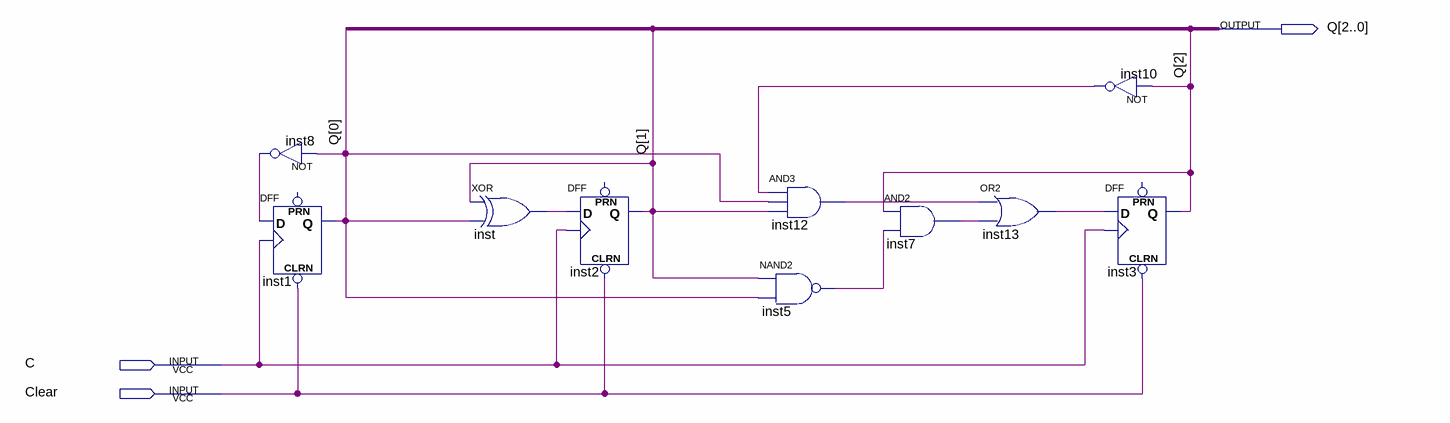
[diagram p0: schematic sheet]
// Quartus schematic SyncCNT.bdf as structural Verilog: 10 symbols, 3 pins
module SyncCNT (
  input  C,
  input  Clear,
  output [2:0] Q
);

  wire inst5_out, inst7_out, inst8_out, inst10_out, inst12_out, inst13_out, inst_out;

  not inst8 (inst8_out, Q[0]);
  DFF inst1 (.CLRN(Clear), .CLK(C), .D(inst8_out), .Q(Q[0]));  // open: PRN
  xor inst (inst_out, Q[1], Q[0]);
  DFF inst2 (.CLRN(Clear), .CLK(C), .D(inst_out), .Q(Q[1]));  // open: PRN
  and inst12 (inst12_out, inst10_out, Q[0], Q[1]);
  nand inst5 (inst5_out, Q[1], Q[0]);
  and inst7 (inst7_out, Q[2], inst5_out);
  or inst13 (inst13_out, inst12_out, inst7_out);
  not inst10 (inst10_out, Q[2]);
  DFF inst3 (.CLRN(Clear), .CLK(C), .D(inst13_out), .Q(Q[2]));  // open: PRN
endmodule
